# Altium project CL-AHU-V1.1.PrjPCB
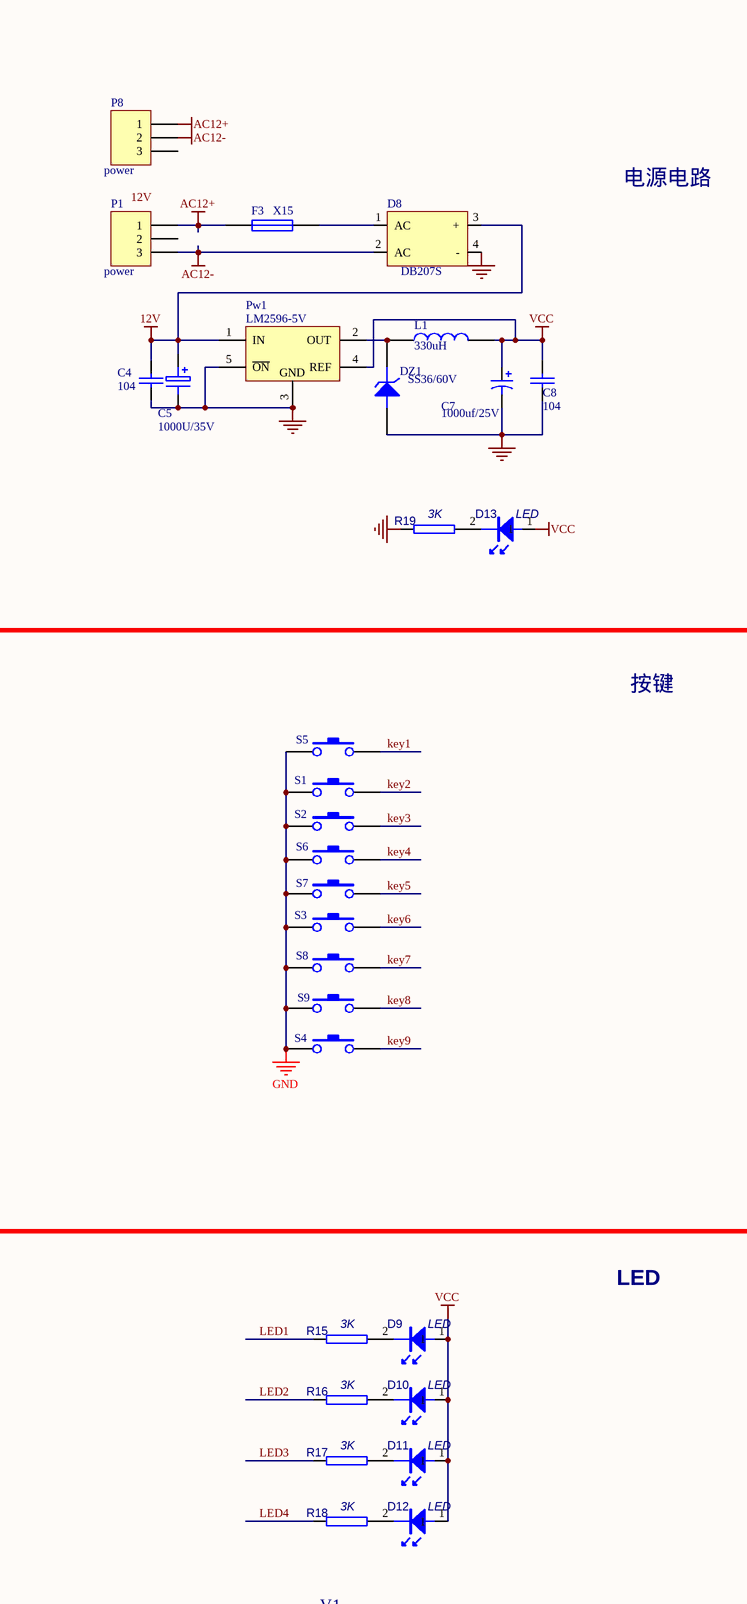
[diagram p0: CL-AHU-V1.1.SchDoc, top left]
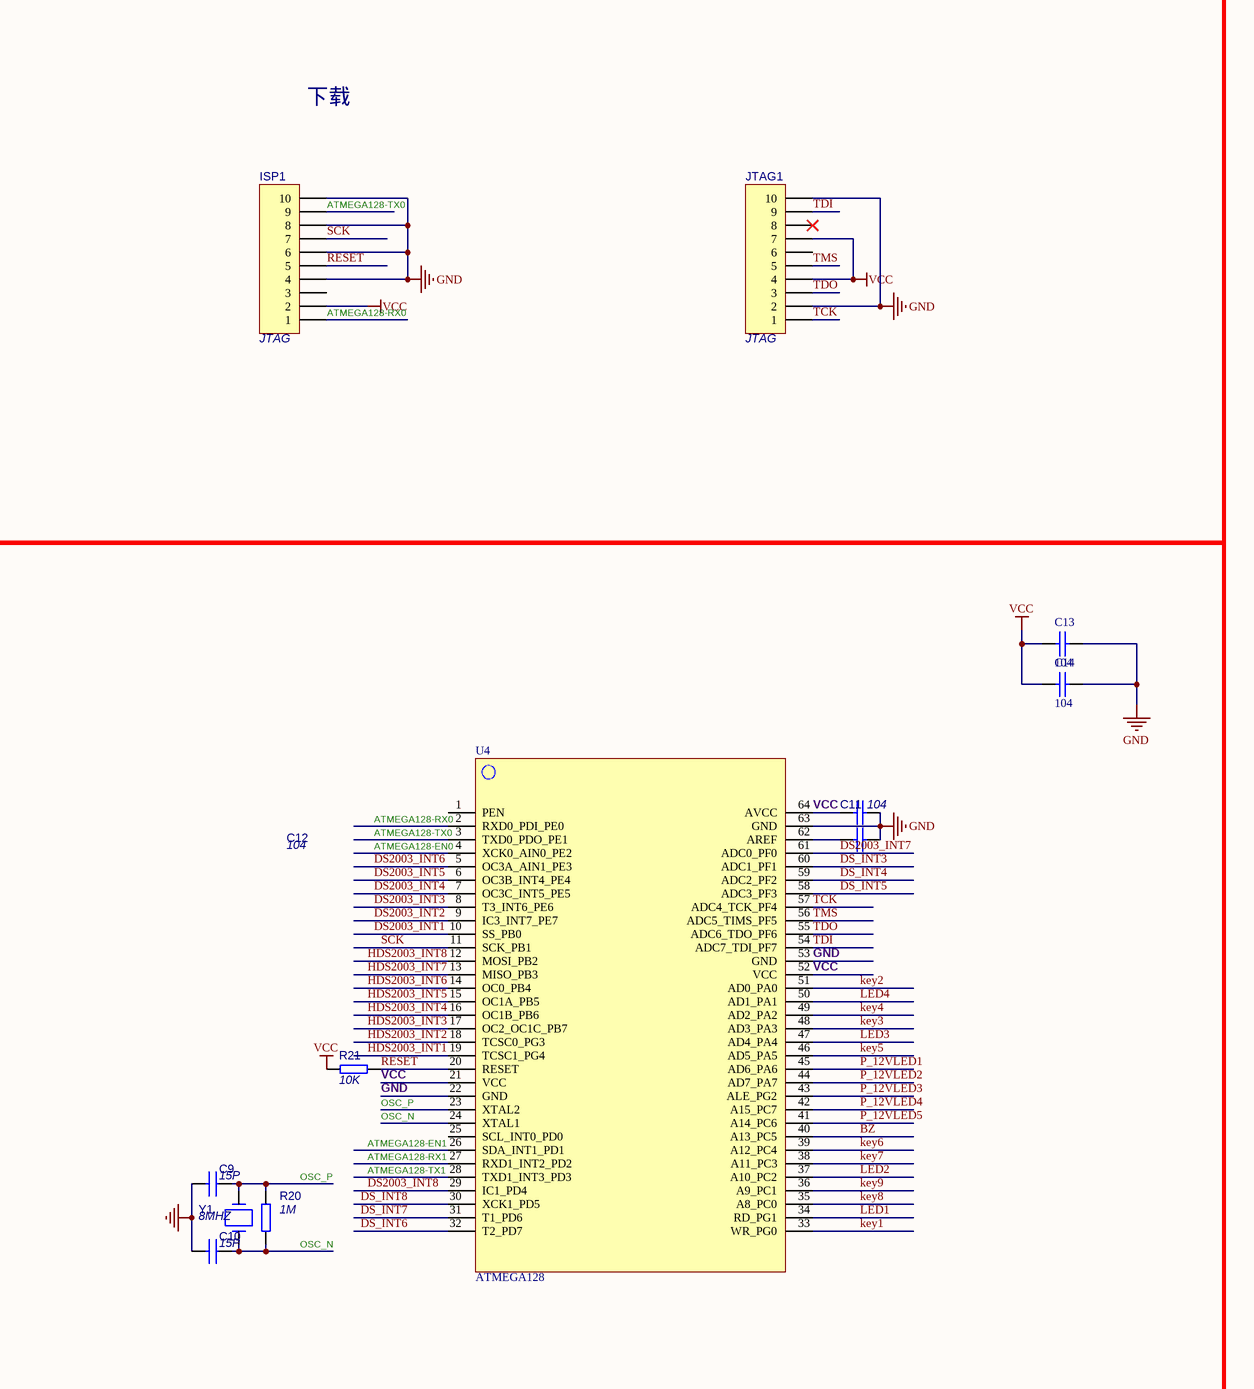
[diagram p1: CL-AHU-V1.1.SchDoc, top right]
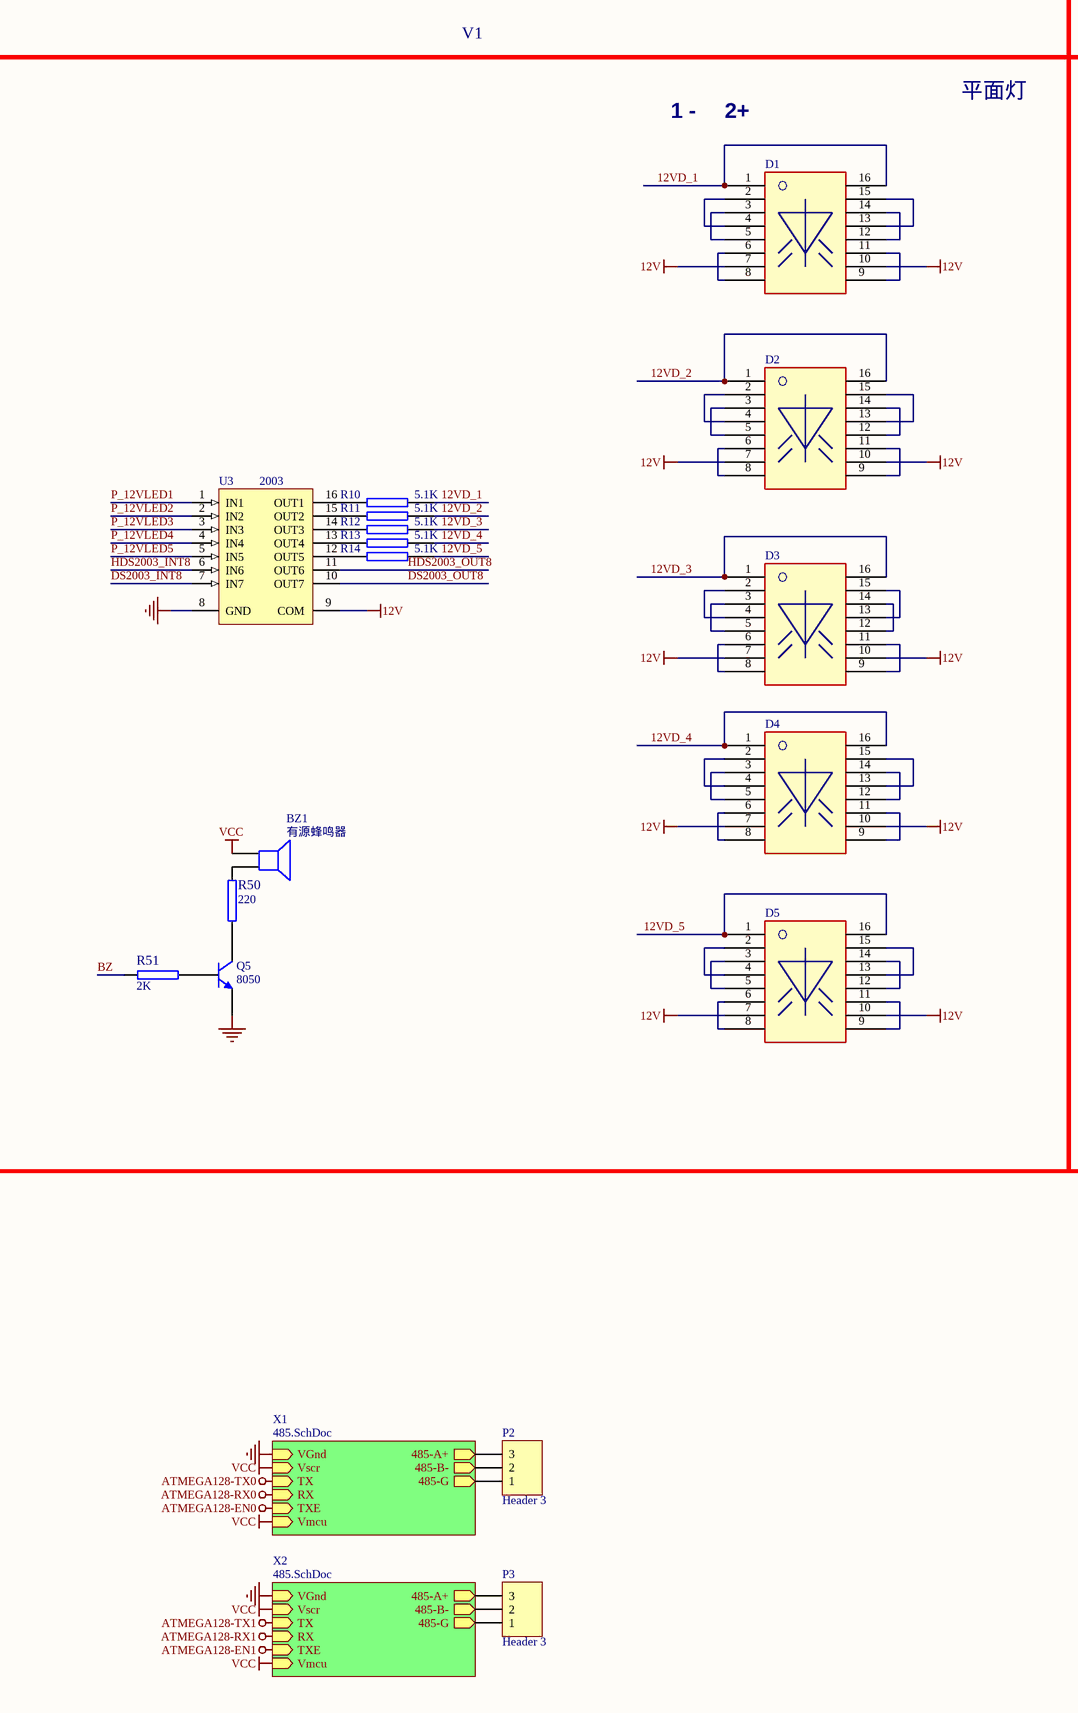
[diagram p2: CL-AHU-V1.1.SchDoc, bottom left]
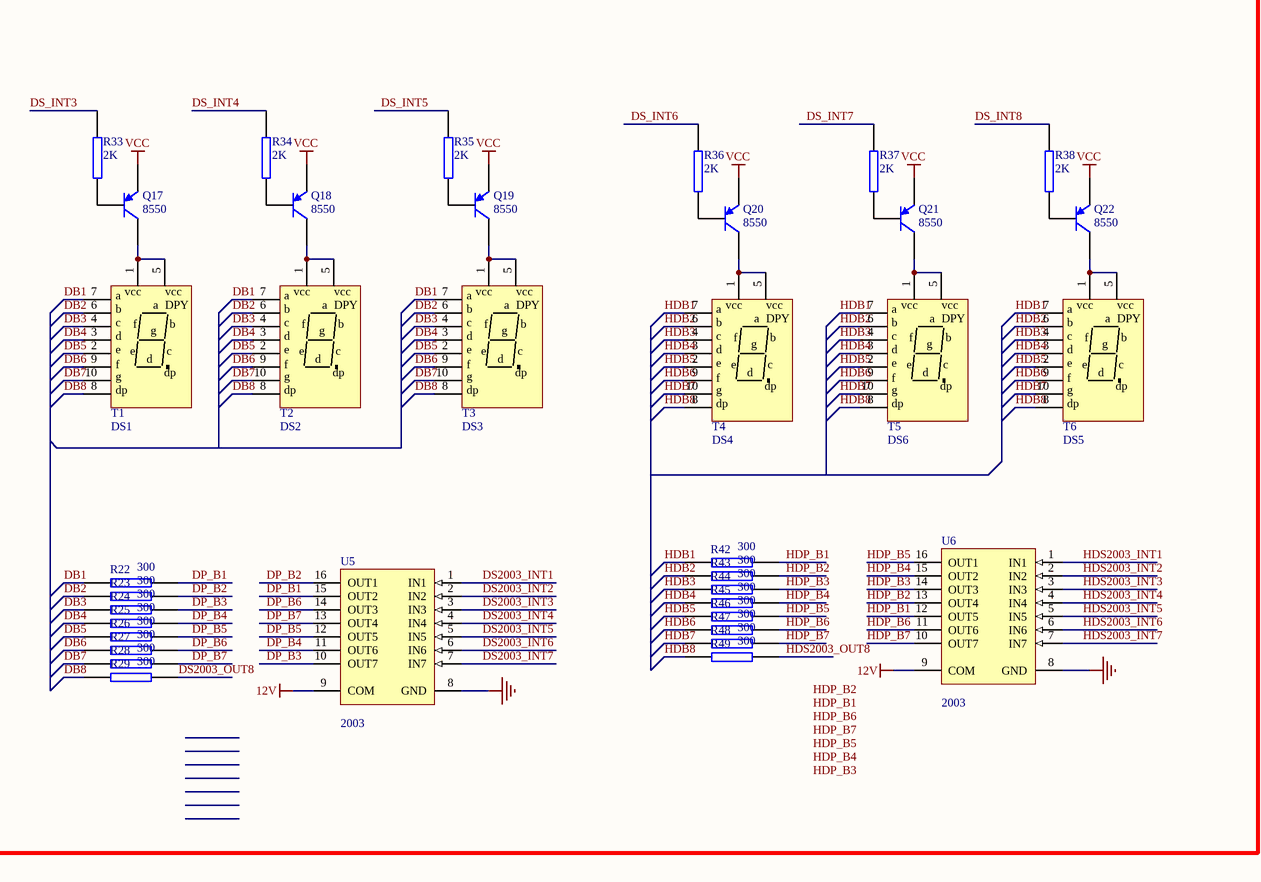
[diagram p3: CL-AHU-V1.1.SchDoc, bottom right]
2 sheets, 143 parts. Net scope: hierarchical (ports join the sheet entries above them; power ports are global).
Board file: CL-AHU-V1.1.pcbdoc
Sheets:
  CL-AHU-V1.1.SchDoc
    X1 = 485.SchDoc
    X2 = 485.SchDoc

## Sheet CL-AHU-V1.1.SchDoc
size A0

### Parts
BZ1  有源蜂鸣器  [SPK]
C4  104  [C0805]
C5  1000U/35V  [铝电解电容]
C7  1000uf/25V  [铝电解电容]
C8  104  [C0805]
C9  15P  [C0805]
C10  15P  [C0805]
C11  104  [C0805]
C12  104  [C0805]
C13  104  [c0805]
C14  104  [c0805]
D1  PLED  [PLED]  (value not drawn)
D2  PLED  [PLED]  (value not drawn)
D3  PLED  [PLED]  (value not drawn)
D4  PLED  [PLED]  (value not drawn)
D5  PLED  [PLED]  (value not drawn)
D8  DB207S  [Brg]
D9  LED  [LED]
D10  LED  [LED]
D11  LED  [LED]
D12  LED  [LED]
D13  LED  [LED0805]
DZ1  SS36/60V  [SMBJ_SMT]
F3  X15  [PPTC_SMT]
ISP1  JTAG  [FC10]
JTAG1  JTAG  [FC J]
L1  330uH  [CD75]
P1  power  [PL3Q]
P2  Header 3  [PL3Q]
P3  Header 3  [PL3Q]
P8  power  [VH3.96-2]
Pw1  LM2596-5V  [LM2575]
Q5  8050  [SOT23]
Q17  8550  [SOT23]
Q18  8550  [SOT23]
Q19  8550  [SOT23]
Q20  8550  [SOT23]
Q21  8550  [SOT23]
Q22  8550  [SOT23]
R10  5.1K  [0805r]
R11  5.1K  [0805r]
R12  5.1K  [0805r]
R13  5.1K  [0805r]
R14  5.1K  [0805r]
R15  3K  [0805R]
R16  3K  [0805R]
R17  3K  [0805R]
R18  3K  [0805R]
R19  3K  [0805R]
R20  1M  [0805R]
R21  10K  [0805R]
R22  300  [0805R]
R23  300  [0805R]
R24  300  [0805R]
R25  300  [0805R]
R26  300  [0805R]
R27  300  [0805R]
R28  300  [0805R]
R29  300  [0805R]
R33  2K  [0805r]
R34  2K  [0805r]
R35  2K  [0805r]
R36  2K  [0805r]
R37  2K  [0805r]
R38  2K  [0805r]
R42  300  [0805R]
R43  300  [0805R]
R44  300  [0805R]
R45  300  [0805R]
R46  300  [0805R]
R47  300  [0805R]
R48  300  [0805R]
R49  300  [0805R]
R50  220  [0805r]
R51  2K  [0805r]
S1  (no value)  [KEYL]
S2  (no value)  [KEYL]
S3  (no value)  [KEYL]
S4  (no value)  [KEYL]
S5  (no value)  [KEYL]
S6  (no value)  [KEYL]
S7  (no value)  [KEYL]
S8  (no value)  [KEYL]
S9  (no value)  [KEYL]
T1  DS1  [LN12101B62B-2C]
T2  DS2  [LN12101B62B-2C]
T3  DS3  [LN12101B62B-2C]
T4  DS4  [LN12101B62B-2C]
T5  DS6  [LN12101B62B-2C]
T6  DS5  [LN12101B62B-2C]
U3  2003  [SOP-16]
U4  ATMEGA128  [ATMEGA128-64]
U5  2003  [SOP-16]
U6  2003  [SOP-16]
Y1  8MHZ  [XAL2]

### Blocks framed on the sheet
电源电路: C4 C5 C7 C8 D8 D13 DZ1 F3 L1 P1 P8 Pw1 R19
下载: ISP1 JTAG1
按键: S1-S9
LED: D9-D12 R15-R18

### Sub-sheets
X1 = 485.SchDoc: VGnd (in), Vscr (in), TX (in), RX (in), TXE (in), Vmcu (in), 485-A+ (out), 485-B- (out), 485-G (out)
X2 = 485.SchDoc: VGnd (in), Vscr (in), TX (in), RX (in), TXE (in), Vmcu (in), 485-A+ (out), 485-B- (out), 485-G (out)

### Nets
12V: C4.1 C5.1 D1.7 D1.10 D2.7 D2.10 D3.7 D3.10 D4.7 D4.10 D5.7 D5.10 D8.3(+) Pw1.1(IN) U3.9(COM) U5.9(COM) U6.9(COM)
485-GND: P2.1 P3.1 ; sheet X1/485-G, sheet X2/485-G
AC12+: F3.1 P1.1 P8.1
AC12-: D8.2(AC) P1.3 P8.2
ATMEGA128-EN0: U4.4(XCK0_AIN0_PE2) ; sheet X1/TXE
ATMEGA128-EN1: U4.26(SDA_INT1_PD1) ; sheet X2/TXE
ATMEGA128-RX0: ISP1.1 U4.2(RXD0_PDI_PE0) ; sheet X1/RX
ATMEGA128-RX1: U4.27(RXD1_INT2_PD2) ; sheet X2/RX
ATMEGA128-TX0: ISP1.9 U4.3(TXD0_PDO_PE1) ; sheet X1/TX
ATMEGA128-TX1: U4.28(TXD1_INT3_PD3) ; sheet X2/TX
GND: C4.2 C5.2 C7.2 C8.2 C9.2 C10.2 C11.2 C12.2 C13.2 C14.2 D8.4(-) DZ1.A ISP1.4 ISP1.6 ISP1.8 ISP1.10 JTAG1.2 JTAG1.10 Pw1.3(GND) Pw1.5(~{ON}) Q5.3(E) R19.1 S1.1 S2.1 S3.1 S4.1 S5.1 S6.1 S7.1 S8.1 S9.1 U3.8(GND) U4.22(GND) U4.53(GND) U4.63(GND) U5.8(GND) U6.8(GND) ; sheet X1/VGnd, sheet X2/VGnd
VCC: BZ1.1 C7.1 C8.1 C11.1 C13.1 C14.1 D9.1 D10.1 D11.1 D12.1 D13.1 ISP1.2 JTAG1.4 JTAG1.7 L1.2 Pw1.4(REF) Q17.3(E) Q18.3(E) Q19.3(E) Q20.3(E) Q21.3(E) Q22.3(E) R21.2 U4.21(VCC) U4.52(VCC) U4.64(AVCC) ; sheet X1/Vscr, sheet X1/Vmcu, sheet X2/Vscr, sheet X2/Vmcu
12VD_1: D1.1 D1.16 R10.2
12VD_2: D2.1 D2.16 R11.2
12VD_3: D3.1 D3.16 R12.2
12VD_4: D4.1 D4.16 R13.2
12VD_5: D5.1 D5.16 R14.2
485-A: P2.3 ; sheet X1/485-A+
485-A: P3.3 ; sheet X2/485-A+  [a separate net that carries the same name]
485-B: P2.2 ; sheet X1/485-B-
485-B: P3.2 ; sheet X2/485-B-  [a separate net that carries the same name]
BZ: R51.1 U4.40(A13_PC5)
DB1: R22.1 T1.7(f) T2.7(f) T3.7(f)
DB2: R23.1 T1.6(g) T2.6(g) T3.6(g)
DB3: R24.1 T1.4(e) T2.4(e) T3.4(e)
DB4: R25.1 T1.3(d) T2.3(d) T3.3(d)
DB5: R26.1 T1.2(c) T2.2(c) T3.2(c)
DB6: R27.1 T1.9(a) T2.9(a) T3.9(a)
DB7: R28.1 T1.10(b) T2.10(b) T3.10(b)
DB8: R29.1 T1.8(dp) T2.8(dp) T3.8(dp)
DP_B1: R22.2 U5.15(OUT2)
DP_B2: R23.2 U5.16(OUT1)
DP_B3: R24.2 U5.10(OUT7)
DP_B4: R25.2 U5.11(OUT6)
DP_B5: R26.2 U5.12(OUT5)
DP_B6: R27.2 U5.14(OUT3)
DP_B7: R28.2 U5.13(OUT4)
DS2003_INT1: U4.10(SS_PB0) U5.1(IN1)
DS2003_INT2: U4.9(IC3_INT7_PE7) U5.2(IN2)
DS2003_INT3: U4.8(T3_INT6_PE6) U5.3(IN3)
DS2003_INT4: U4.7(OC3C_INT5_PE5) U5.4(IN4)
DS2003_INT5: U4.6(OC3B_INT4_PE4) U5.5(IN5)
DS2003_INT6: U4.5(OC3A_AIN1_PE3) U5.6(IN6)
DS2003_INT7: U4.61(ADC0_PF0) U5.7(IN7)
DS2003_INT8: U3.7(IN7) U4.29(IC1_PD4)
DS2003_OUT8: R29.2 U3.10(OUT7)
DS_INT3: R33.2 U4.60(ADC1_PF1)
DS_INT4: R34.2 U4.59(ADC2_PF2)
DS_INT5: R35.2 U4.58(ADC3_PF3)
DS_INT6: R36.2 U4.32(T2_PD7)
DS_INT7: R37.2 U4.31(T1_PD6)
DS_INT8: R38.2 U4.30(XCK1_PD5)
HDB1: R42.1 T4.7(f) T5.7(f) T6.7(f)
HDB2: R43.1 T4.6(g) T5.6(g) T6.6(g)
HDB3: R44.1 T4.4(e) T5.4(e) T6.4(e)
HDB4: R45.1 T4.3(d) T5.3(d) T6.3(d)
HDB5: R46.1 T4.2(c) T5.2(c) T6.2(c)
HDB6: R47.1 T4.9(a) T5.9(a) T6.9(a)
HDB7: R48.1 T4.10(b) T5.10(b) T6.10(b)
HDB8: R49.1 T4.8(dp) T5.8(dp) T6.8(dp)
HDP_B1: R42.2 U6.12(OUT5)
HDP_B2: R43.2 U6.13(OUT4)
HDP_B3: R44.2 U6.14(OUT3)
HDP_B4: R45.2 U6.15(OUT2)
HDP_B5: R46.2 U6.16(OUT1)
HDP_B6: R47.2 U6.11(OUT6)
HDP_B7: R48.2 U6.10(OUT7)
HDS2003_INT1: U4.19(TCSC1_PG4) U6.1(IN1)
HDS2003_INT2: U4.18(TCSC0_PG3) U6.2(IN2)
HDS2003_INT3: U4.17(OC2_OC1C_PB7) U6.3(IN3)
HDS2003_INT4: U4.16(OC1B_PB6) U6.4(IN4)
HDS2003_INT5: U4.15(OC1A_PB5) U6.5(IN5)
HDS2003_INT6: U4.14(OC0_PB4) U6.6(IN6)
HDS2003_INT7: U4.13(MISO_PB3) U6.7(IN7)
HDS2003_INT8: U3.6(IN6) U4.12(MOSI_PB2)
HDS2003_OUT8: R49.2 U3.11(OUT6)
key1: S5.2 U4.33(WR_PG0)
key2: S1.2 U4.51(AD0_PA0)
key3: S2.2 U4.48(AD3_PA3)
key4: S6.2 U4.49(AD2_PA2)
key5: S7.2 U4.46(AD5_PA5)
key6: S3.2 U4.39(A12_PC4)
key7: S8.2 U4.38(A11_PC3)
key8: S9.2 U4.35(A8_PC0)
key9: S4.2 U4.36(A9_PC1)
LED1: R15.1 U4.34(RD_PG1)
LED2: R16.1 U4.37(A10_PC2)
LED3: R17.1 U4.47(AD4_PA4)
LED4: R18.1 U4.50(AD1_PA1)
OSC_N: C10.1 R20.1 U4.24(XTAL1) Y1.2
OSC_P: C9.1 R20.2 U4.23(XTAL2) Y1.1
P_12VLED1: U3.1(IN1) U4.45(AD6_PA6)
P_12VLED2: U3.2(IN2) U4.44(AD7_PA7)
P_12VLED3: U3.3(IN3) U4.43(ALE_PG2)
P_12VLED4: U3.4(IN4) U4.42(A15_PC7)
P_12VLED5: U3.5(IN5) U4.41(A14_PC6)
RESET: ISP1.5 R21.1 U4.20(RESET)
SCK: ISP1.7 U4.11(SCK_PB1)
TCK: JTAG1.1 U4.57(ADC4_TCK_PF4)
TDI: JTAG1.9 U4.54(ADC7_TDI_PF7)
TDO: JTAG1.3 U4.55(ADC6_TDO_PF6)
TMS: JTAG1.5 U4.56(ADC5_TIMS_PF5)
NetBZ1_2: BZ1.2 R50.2
NetC12_1: C12.1 U4.62(AREF)
NetD1_2: D1.2 D1.4
NetD1_3: D1.3 D1.5
NetD1_6: D1.6 D1.8
NetD1_9: D1.9 D1.11
NetD1_12: D1.12 D1.14
NetD1_13: D1.13 D1.15
NetD2_2: D2.2 D2.4
NetD2_3: D2.3 D2.5
NetD2_6: D2.6 D2.8
NetD2_9: D2.9 D2.11
NetD2_12: D2.12 D2.14
NetD2_13: D2.13 D2.15
NetD3_2: D3.2 D3.4
NetD3_3: D3.3 D3.5
NetD3_6: D3.6 D3.8
NetD3_9: D3.9 D3.11
NetD3_12: D3.12 D3.14
NetD3_13: D3.13 D3.15
NetD4_2: D4.2 D4.4
NetD4_3: D4.3 D4.5
NetD4_6: D4.6 D4.8
NetD4_9: D4.9 D4.11
NetD4_12: D4.12 D4.14
NetD4_13: D4.13 D4.15
NetD5_2: D5.2 D5.4
NetD5_3: D5.3 D5.5
NetD5_6: D5.6 D5.8
NetD5_9: D5.9 D5.11
NetD5_12: D5.12 D5.14
NetD5_13: D5.13 D5.15
NetD8_1: D8.1(AC) F3.2
NetD9_2: D9.2 R15.2
NetD10_2: D10.2 R16.2
NetD11_2: D11.2 R17.2
NetD12_2: D12.2 R18.2
NetD13_2: D13.2 R19.2
NetDZ1_K: DZ1.K L1.1 Pw1.2(OUT)
NetQ5_1: Q5.1(C) R50.1
NetQ5_2: Q5.2(B) R51.2
NetQ17_1: Q17.1(C) T1.1(VCC) T1.5(a)
NetQ17_2: Q17.2(B) R33.1
NetQ18_1: Q18.1(C) T2.1(VCC) T2.5(a)
NetQ18_2: Q18.2(B) R34.1
NetQ19_1: Q19.1(C) T3.1(VCC) T3.5(a)
NetQ19_2: Q19.2(B) R35.1
NetQ20_1: Q20.1(C) T4.1(VCC) T4.5(a)
NetQ20_2: Q20.2(B) R36.1
NetQ21_1: Q21.1(C) T5.1(VCC) T5.5(a)
NetQ21_2: Q21.2(B) R37.1
NetQ22_1: Q22.1(C) T6.1(VCC) T6.5(a)
NetQ22_2: Q22.2(B) R38.1
NetR10_1: R10.1 U3.16(OUT1)
NetR11_1: R11.1 U3.15(OUT2)
NetR12_1: R12.1 U3.14(OUT3)
NetR13_1: R13.1 U3.13(OUT4)
NetR14_1: R14.1 U3.12(OUT5)

Not connected (* = marked no-connect by the designer): ISP1 3; JTAG1 6 8*; P1 2; P8 3; U4 1(PEN) 25(SCL_INT0_PD0)

### Notes on the sheet
- V1
- 1 -
- 2+
- 平面灯
- Labels drawn without touching a wire or pin: 12V, HDP_B1, HDP_B2, HDP_B3, HDP_B4, HDP_B5, HDP_B6, HDP_B7
- Title
- Size:
- Date:
- File:
- A0
- Number:
- Time:
- Revision:
- Sheet
- of
- (in symbol DS) vcc; DPY

### Library data of the parts
BZ1 = Speaker: Loudspeaker; 采购信息: 4KHz,无源,SOT塑封管,优质; Published: 24-Mar-1999; LatestRevisionDate: 17-Jul-2002; LatestRevisionNote: Re-released for DXP Platform.; PackageReference: PIN2; Publisher: Altium Limited
C4 C8 C11 C12 = CAP: Capacitor; 采购信息: 0.1uF X7R,5%,50V,贴片电容
C5 = ELECTRO1: Electrolytic Capacitor; 采购信息: 1000uf/25V 插件电解电容
C7 = Cap Pol1: Polarized Capacitor (Radial); 采购信息: 1000uf/25V 插件电解电容; Published: 8-Jun-2000; LatestRevisionDate: 17-Jul-2002; LatestRevisionNote: Re-released for DXP Platform.; PackageReference: RB7.6-15; Publisher: Altium Limited
C9 C10 = CAP NP
C13 C14 = CAP: Capacitor
D1-D5 = D1
D8 = Bridge
DZ1 = ZENER3: Zener Diode; 采购信息: SS36/60V  SMB 3A/60V
F3 = Fuse 1: Fuse; 采购信息: 贴片保险丝 140mA X14 2512封装; Published: 8-Jun-2000; LatestRevisionDate: 17-Jul-2002; LatestRevisionNote: Re-released for DXP Platform.; PackageReference: PIN-W2/E2.8; Publisher: Altium Limited
ISP1 JTAG1 = CON10: Connector
L1 = INDUCTOR: 采购信息: 10uH 贴片 12*12mm
P1-P3 P8 = Header 3: Header, 3-Pin; LatestRevisionDate: 17-Jul-2002; LatestRevisionNote: Re-released for DXP Platform.; Publisher: Altium Limited
Pw1 = LM2576: 采购信息: LM2576 5V 国产 贴片
Q5 = NPN: NPN Bipolar Transistor; 采购信息: SOT23封装; Published: 8-Jun-2000; LatestRevisionDate: 17-Jul-2002; LatestRevisionNote: Re-released for DXP Platform.; PackageReference: TO-226; Publisher: Altium Limited; Code_JEDEC: TO-226-AA
Q17-Q22 = PNP: PNP Bipolar Transistor; 采购信息: 贴片 8550 SOT23; Published: 8-Jun-2000; LatestRevisionDate: 29-May-2009; LatestRevisionNote: IPC-7351 Footprint Added.; PackageReference: SOT-23B; Publisher: Altium Limited; PackageVersion: Aug-1999; PackageDescription: 3-Pin SOT-23 Package 0.95 mm Pitch, 2.4 mm Lead Span
R10-R19 R22-R29 R42-R51 = RES2
R20 R21 = res
R33-R38 = RES2: 采购信息: 2K 5%,0.25W
S1-S9 = SW-PB
T1-T6 = DS
U3 U5 U6 = ULN2003A: High-Voltage, High-Current Darlington Array; Published: *; LatestRevisionDate: *; LatestRevisionNote: *; DatasheetVersion: *; PackageVersion: *; PackageReference: *; Publisher: *; PackageDescription: *; Code_JEDEC: *; ComponentLink1Description: *; ComponentLink1URL: *
U4 = ATMEGA64
Y1 = CRYSTAL

## Sheet 485.SchDoc
size A4
Used 2 times, as channels X1, X2. Parts and nets are listed once, with the designators drawn on the sheet.
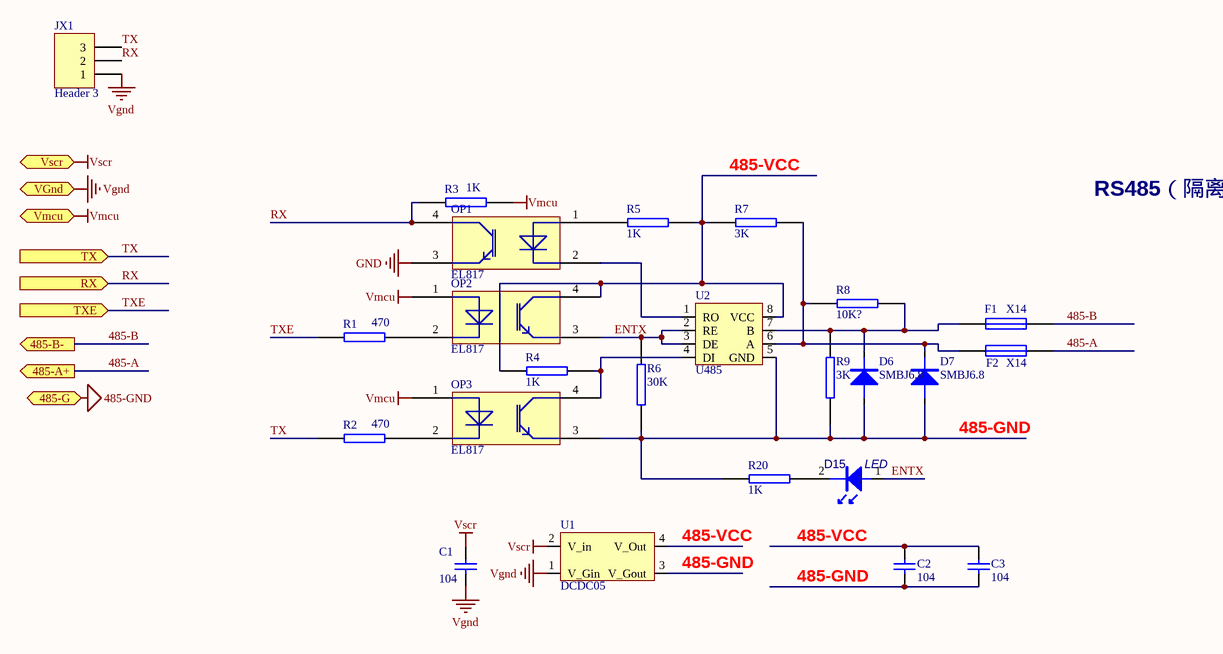
[diagram p4: 485.SchDoc]

### Parts
C1  104  [C0805]
C2  104  [C0805]
C3  104  [C0805]
D6  SMBJ6.8  [SMBJ_SMT]
D7  SMBJ6.8  [SMBJ_SMT]
D15  LED  [LED0805]
F1  X14  [PPTC_SMT]
F2  X14  [PPTC_SMT]
JX1  Header 3  [HDR1X3]
OP1  EL817  [PS2701]
OP2  EL817  [PS2701]
OP3  EL817  [PS2701]
R1  470  [0805R]
R2  470  [0805R]
R3  1K  [0805R]
R4  1K  [0805R]
R5  1K  [0805R]
R6  30K  [0805R]
R7  3K  [0805R]
R8  10K?  [0805R]
R9  3K  [0805R]
R20  1K  [0805R]
U1  DCDC05  [VScore]
U2  U485  [SOP8]

### Ports
485-A+ (out), 485-B- (out), 485-G (out), RX (in), TX (in), TXE (in), VGnd (in), Vmcu (in), Vscr (in)

### Nets
485-GND: C2.1 C3.1 D6.A D7.A OP3.3 R6.1 R9.1 R20.1 U1.3(V_Gout) U2.5(GND) ; port 485-G
GND: OP1.3
Vgnd: C1.1 JX1.1 U1.1(V_Gin) ; port VGnd
Vmcu: OP2.1 OP3.1 R3.1 ; port Vmcu
Vscr: C1.2 U1.2(V_in) ; port Vscr
485-A: F2.1 ; port 485-A+
485-B: F1.1 ; port 485-B-
485-VCC: C2.2 C3.2 OP2.4 R4.1 R5.2 R7.2 U1.4(V_Out) U2.8(VCC)
ENTX: D15.1 OP2.3 R6.2 U2.2(RE) U2.3(DE)
RX: JX1.2 OP1.4 R3.2 ; port RX
TX: JX1.3 R2.2 ; port TX
TXE: R1.2 ; port TXE
NetD6_K: D6.K F1.2 R8.1 R9.2 U2.7(B)
NetD7_K: D7.K F2.2 R7.1 R8.2 U2.6(A)
NetD15_2: D15.2 R20.2
NetOP1_1: OP1.1 R5.1
NetOP1_2: OP1.2 U2.1(RO)
NetOP2_2: OP2.2 R1.1
NetOP3_2: OP3.2 R2.1
NetOP3_4: OP3.4 R4.2 U2.4(DI)

### Channels
X1: designators end in _X1; ports 485-A+=485-A 485-B-=485-B 485-G=485-GND RX=ATMEGA128-RX0 TX=ATMEGA128-TX0 TXE=ATMEGA128-EN0 VGnd=GND Vmcu=VCC Vscr=VCC
X2: designators end in _X2; ports 485-A+=485-A 485-B-=485-B 485-G=485-GND RX=ATMEGA128-RX1 TX=ATMEGA128-TX1 TXE=ATMEGA128-EN1 VGnd=GND Vmcu=VCC Vscr=VCC

### Notes on the sheet
- RS485（隔离）
- Title
- Size:
- Date:
- File:
- A0
- Number:
- Time:
- Revision:
- Sheet
- of

### Library data of the parts
C1-C3 = Cap: Capacitor; Published: 8-Jun-2000; LatestRevisionDate: 17-Jul-2002; LatestRevisionNote: Re-released for DXP Platform.; PackageReference: RAD-0.3; Publisher: Altium Limited
D6 D7 = DIODE
F1 F2 = Fuse 1: Fuse; Published: 8-Jun-2000; LatestRevisionDate: 17-Jul-2002; LatestRevisionNote: Re-released for DXP Platform.; PackageReference: PIN-W2/E2.8; Publisher: Altium Limited
JX1 = Header 3: Header, 3-Pin; LatestRevisionDate: 17-Jul-2002; LatestRevisionNote: Re-released for DXP Platform.; Publisher: Altium Limited
R1-R9 R20 = RES2
U1 = VScoure

## Nets that join several sheets
485-GND: CL-AHU-V1.1 (P2.1 P3.1), X1 (10 pins), X2 (10 pins)
ATMEGA128-EN0: CL-AHU-V1.1 (U4.4), X1 (R1_X1.2)
ATMEGA128-EN1: CL-AHU-V1.1 (U4.26), X2 (R1_X2.2)
ATMEGA128-RX0: CL-AHU-V1.1 (ISP1.1 U4.2), X1 (JX1_X1.2 OP1_X1.4 R3_X1.2)
ATMEGA128-RX1: CL-AHU-V1.1 (U4.27), X2 (JX1_X2.2 OP1_X2.4 R3_X2.2)
ATMEGA128-TX0: CL-AHU-V1.1 (ISP1.9 U4.3), X1 (JX1_X1.3 R2_X1.2)
ATMEGA128-TX1: CL-AHU-V1.1 (U4.28), X2 (JX1_X2.3 R2_X2.2)
GND: CL-AHU-V1.1 (37 pins), X1 (C1_X1.1 JX1_X1.1 OP1_X1.3 U1_X1.1), X2 (C1_X2.1 JX1_X2.1 OP1_X2.3 U1_X2.1)
VCC: CL-AHU-V1.1 (26 pins), X1 (5 pins), X2 (5 pins)
485-A: CL-AHU-V1.1 (P2.3), X1 (F2_X1.1)
485-A: CL-AHU-V1.1 (P3.3), X2 (F2_X2.1)
485-B: CL-AHU-V1.1 (P2.2), X1 (F1_X1.1)
485-B: CL-AHU-V1.1 (P3.2), X2 (F1_X2.1)